# EAGLE schematic l2_pcb_v4 (EAGLE 9.7.0)
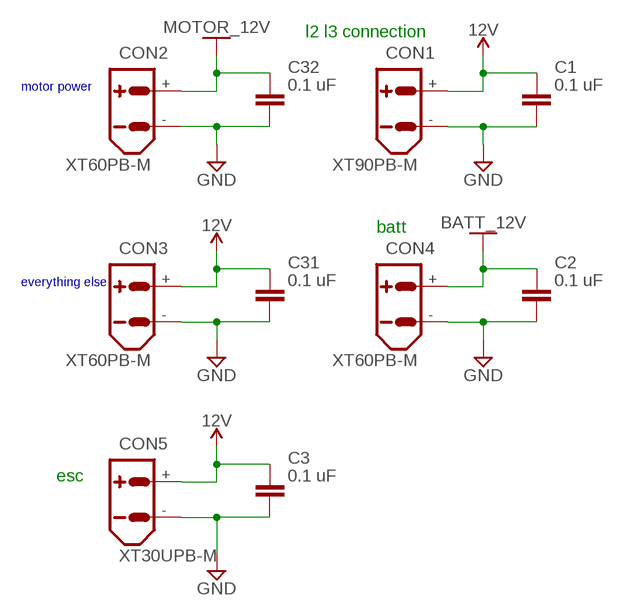
[diagram p0: schematic, sheet 1]

## Parts
C1  0.1 uF  C_CHIP-0603(1608-METRIC)  [CAPC1608X85]
C2  0.1 uF  C_CHIP-0603(1608-METRIC)  [CAPC1608X85]
C3  0.1 uF  C_CHIP-0603(1608-METRIC)  [CAPC1608X85]
C31  0.1 uF  C_CHIP-0603(1608-METRIC)  [CAPC1608X85]
C32  0.1 uF  C_CHIP-0603(1608-METRIC)  [CAPC1608X85]
CON1  XT90PB-M  [XT90PB-M]
CON2  XT60PB-M  [XT60PB-M]
CON3  XT60PB-M  [XT60PB-M]
CON4  XT60PB-M  [XT60PB-M]
CON5  XT30UPB-M  [XT30UPB-M]

## Nets
12V: C1.1 C3.1 C31.1 CON1.+ CON3.+ CON5.+
BATT_12V: C2.1 CON4.+
GND: C1.2 C2.2 C3.2 C31.2 C32.2 CON1.- CON2.- CON3.- CON4.- CON5.-
MOTOR_12V: C32.1 CON2.+

## Notes on the sheet
- l2 l3 connection
- motor power
- batt
- everything else
- esc

## Library data of the parts
C1-C3 C31 C32 = Capacitor:C: Capacitor - Generic; CATEGORY: Capacitor
CON1 = amass xt series:XT90: AMASS XT90 connector Store in Japan AMASS XT90 connector <https://szc.jp/ams-xt90>
CON2-CON4 = amass xt series:XT60: AMASS XT60 connector Store in Japan AMASS XT60 connector <https://szc.jp/ams-xt60>
CON5 = amass xt series:XT30: AMASS XT30 connector Store in Japan AMASS XT30 connector <https://szc.jp/ams-xt30>